# EAGLE schematic v1 (EAGLE 7.5.0)
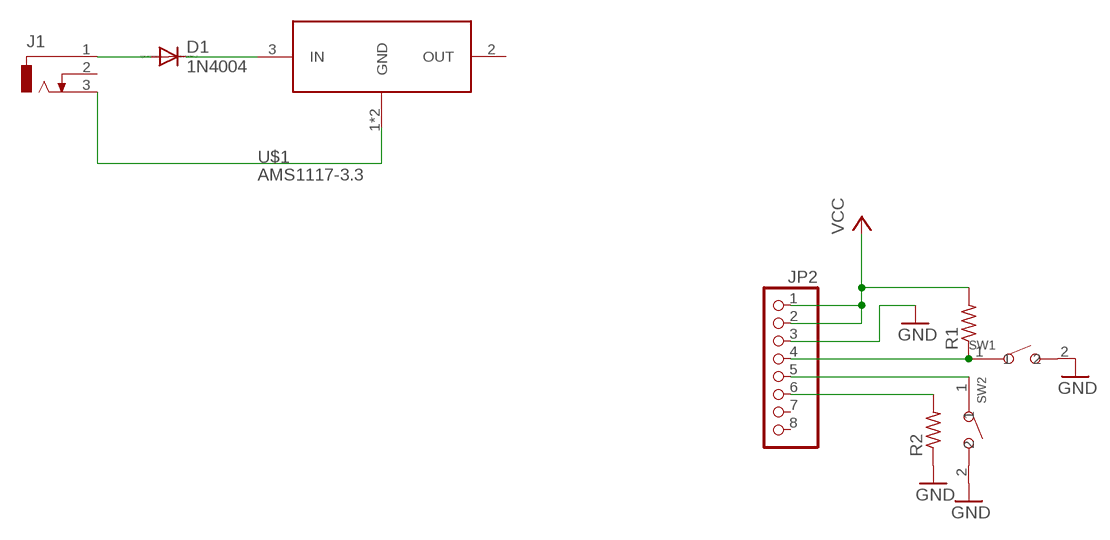
[diagram p0: schematic, sheet 1]

## Parts
D1  1N4004  [DO41-10]
J1  DCJ0303  [DCJ0303]
JP2  PINHD-1X8  [1X08]
R1  R-US_0204/5  [0204/5]
R2  R-US_0204/5  [0204/5]
SW1  DIP-BUTTON(2P-6.0X3.0X4.3MM)-TS-1101F  [SW2-5.0-6.0X3.0X4.3MM]
SW2  DIP-BUTTON(2P-6.0X3.0X4.3MM)-TS-1101F  [SW2-5.0-6.0X3.0X4.3MM]
U$1  AMS1117-3.3  [SOT-223]

## Nets
GND: JP2.3 R2.1 SW1.2 SW2.2
N$1: JP2.4 R1.1 SW1.1
N$2: JP2.5 SW2.1
N$3: JP2.6 R2.2
N$4: D1.A J1.1
N$5: D1.C U$1.3(IN)
N$6: J1.3 U$1.1(GND) U$1.4(GND)
VCC: JP2.1 JP2.2 R1.2
Unconnected: J1.2 JP2.7 JP2.8 U$1.2(OUT)

## Library data of the parts
D1 = diode:1N4004: DIODE general purpose rectifier, 1 A
J1 = con-jack:DCJ0303: DC POWER JACK Source: DCJ0303.pdf; OC_FARNELL: unknown; OC_NEWARK: unknown
JP2 = pinhead:PINHD-1X8: PIN HEADER
R1 R2 = rcl:R-US_: RESISTOR, American symbol
SW1 SW2 = Seeed-OPL-Switch:DIP-BUTTON(2P-6.0X3.0X4.3MM): 311020025
U$1 = AMS1117-3.3:AMS1117-3.3: 1A LOW DROPOUT VOLTAGE REGULATOR